# EAGLE design EEprom_Logger_V1 (EAGLE 9.4.2)
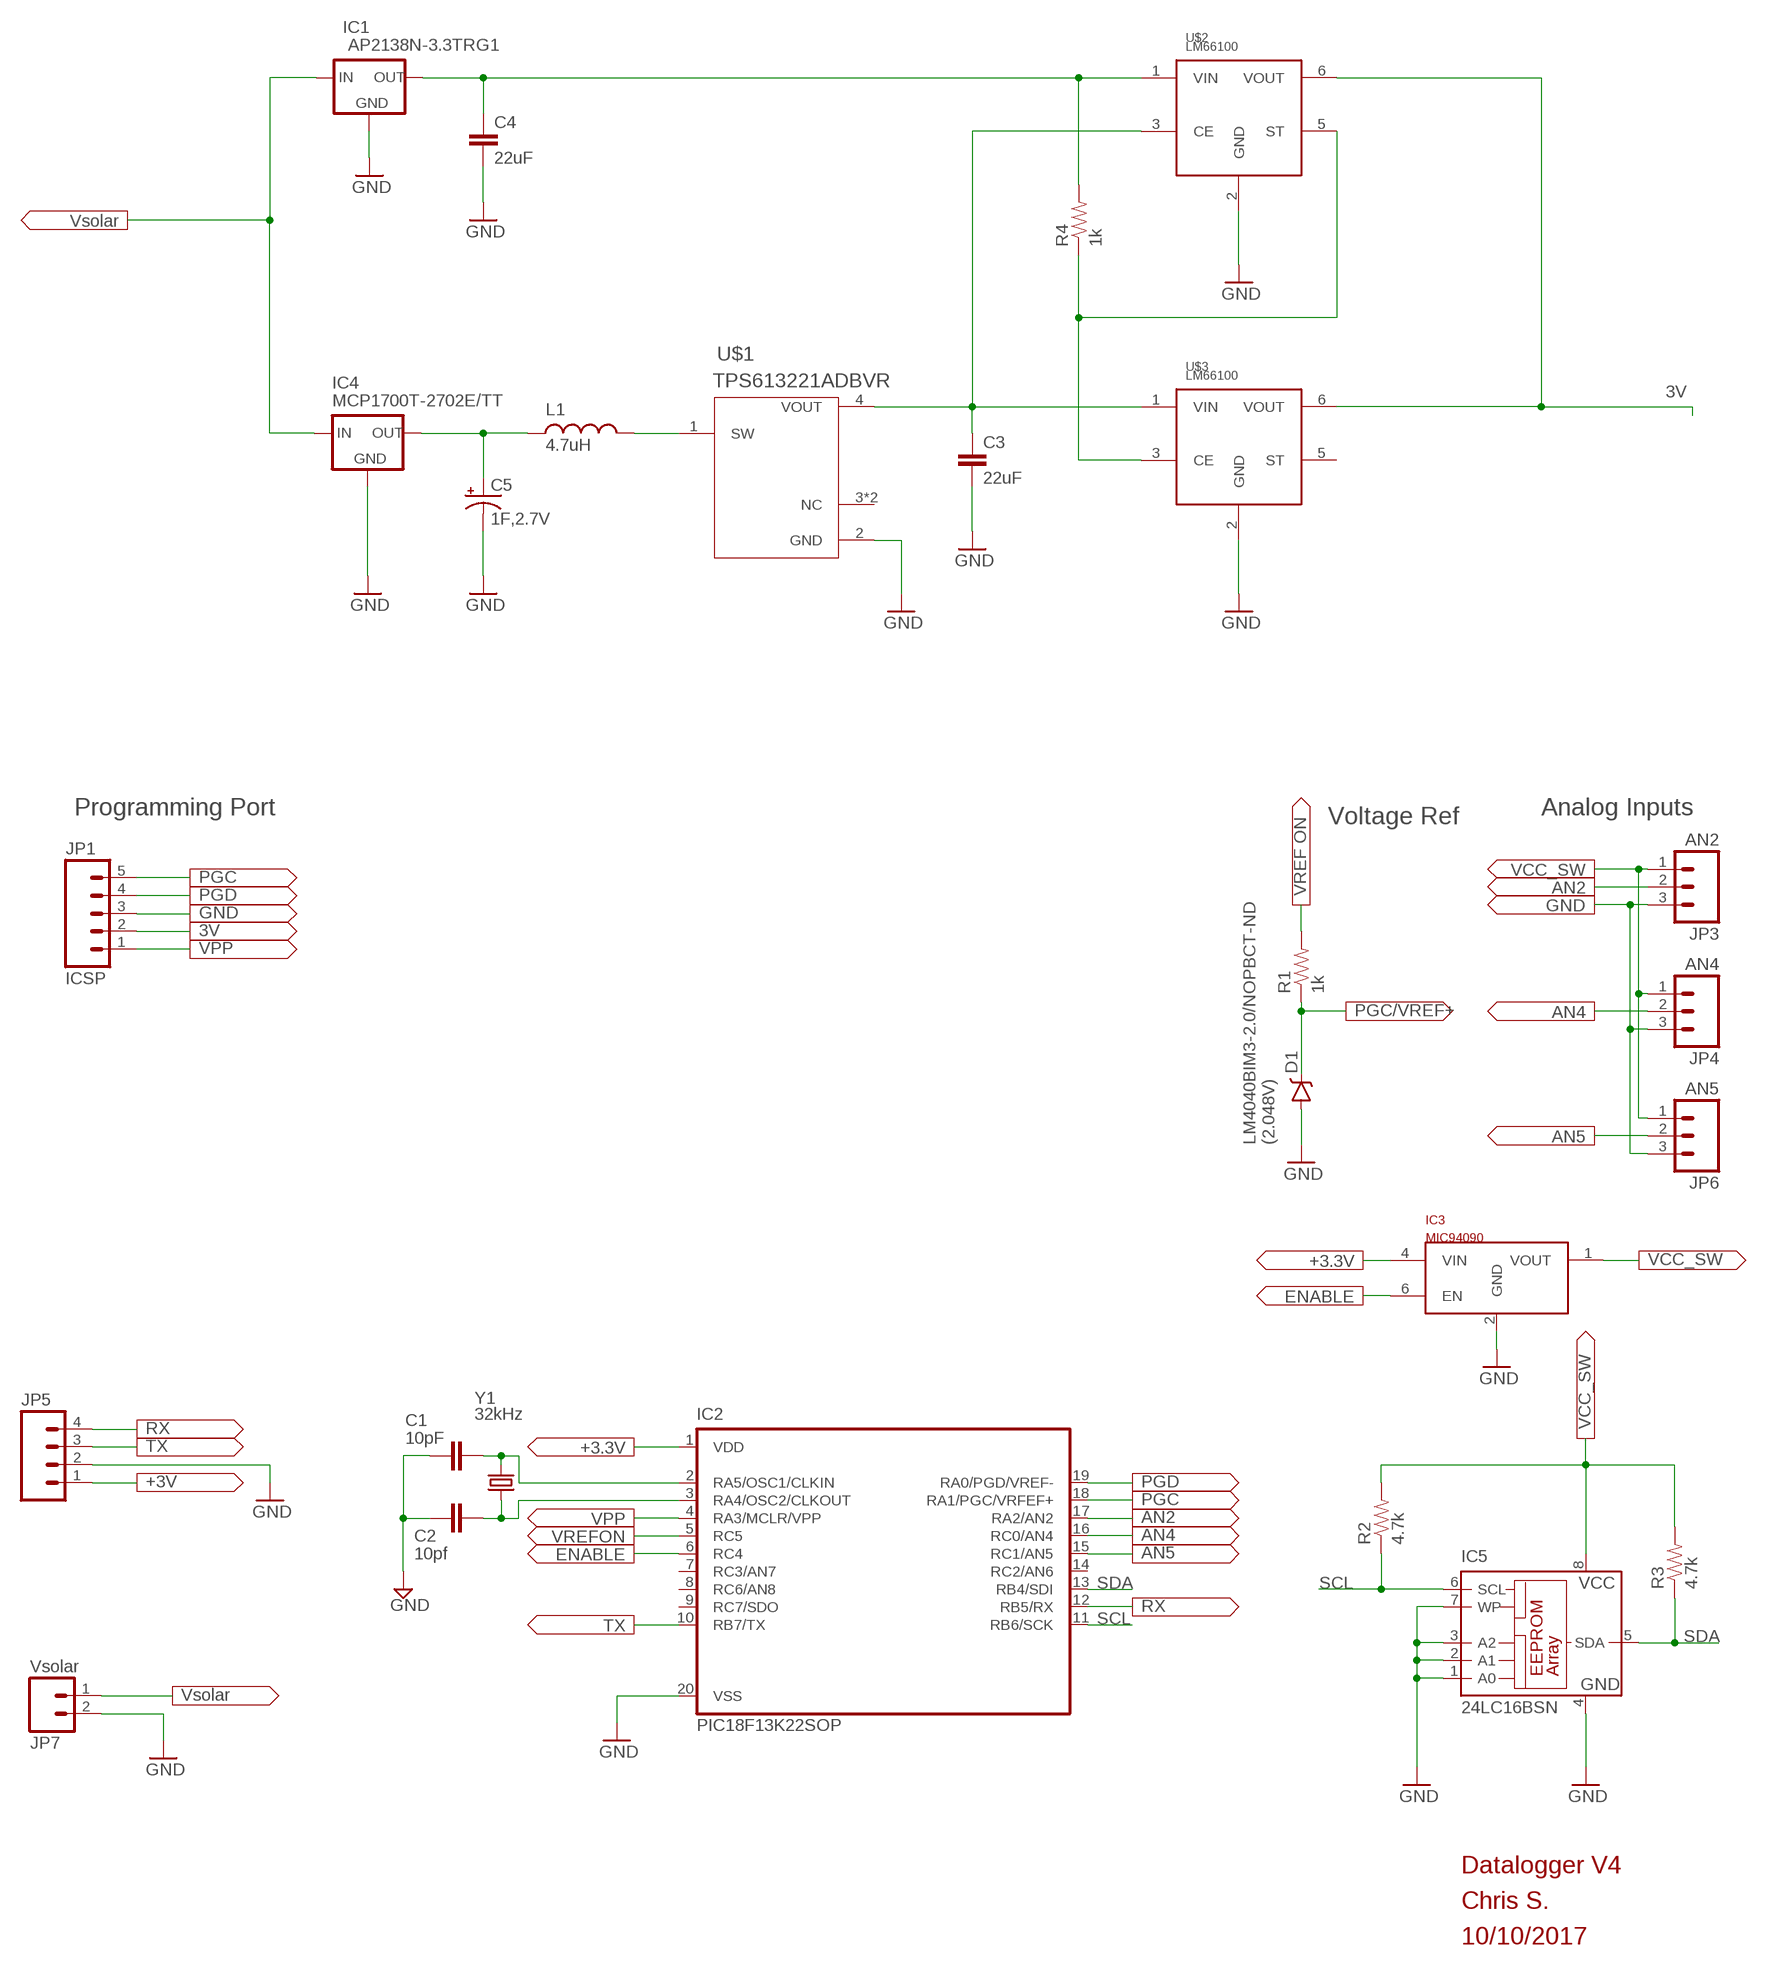
[diagram p0: schematic, sheet 1]

## Parts
C1  10pF  CAP1206  [1206]
C2  10pf  CAP1206  [1206]
C3  22uF  CAP1206  [1206]
C4  22uF  CAP1206  [1206]
C5  1F,2.7V  CPOL-USE3.5-8  [E3,5-8]
D1  V-REFERENCESMD  [SOT23-3]
IC1  AP2138N-3.3TRG1  XC63FPM  [SOT23]
IC2  PIC18F13K22SOP  [SOP20W]
IC3  MIC94090  [SC-70]
IC4  MCP1700T-2702E/TT  XC63FPM  [SOT23]
IC5  24LC16BSN  [SO-08]
JP1  ICSP  M05PTH  [1X05]
JP3  AN2  M03JST-PTH  [JST-3-PTH]
JP4  AN4  M03JST-PTH  [JST-3-PTH]
JP5  M04PTH  [1X04]
JP6  AN5  M03JST-PTH  [JST-3-PTH]
JP7  Vsolar  M02JST-PTH-2  [JST-2-PTH]
L1  4.7uH  INDUCTOR1210  [1210]
R1  1k  RESISTOR1206  [1206]
R2  4.7k  RESISTOR1206  [1206]
R3  4.7k  RESISTOR1206  [1206]
R4  1k  RESISTOR1206  [1206]
U$1  TPS613221ADBVR  TPS61322  [DBV5-L]
U$2  LM66100  [SC70-6]
U$3  LM66100  [SC70-6]
Y1  32kHz  CRYSTALTC26V  [TC26V]

## Nets
3V: IC2.1(VDD) IC3.4(VIN) JP1.2 JP5.1 U$2.6(VOUT) U$3.6(VOUT)
AN2: IC2.17(RA2/AN2) JP3.2
AN4: IC2.16(RC0/AN4) JP4.2
AN5: IC2.15(RC1/AN5) JP6.2
ENABLE: IC2.6(RC4) IC3.6(EN)
GND: C1.2 C2.2 C3.1 C4.1 C5.- D1.2(A) IC1.1(GND) IC2.20(VSS) IC3.2(GND) IC4.1(GND) IC5.1(A0) IC5.2(A1) IC5.3(A2) IC5.4(GND) IC5.7(WP) JP1.3 JP3.3 JP4.3 JP5.2 JP6.3 JP7.2 U$1.2(GND) U$2.2(GND) U$3.2(GND)
N$1: C1.1 IC2.2(RA5/OSC1/CLKIN) Y1.2
N$2: C2.1 IC2.3(RA4/OSC2/CLKOUT) Y1.1
N$3: C4.2 IC1.2(OUT) R4.2 U$2.1(VIN)
N$4: C5.+ IC4.2(OUT) L1.1
N$5: IC1.3(IN) IC4.3(IN)
N$6: R4.1 U$2.5(ST) U$3.3(CE)
N$9: C3.2 U$1.4(VOUT) U$2.3(CE) U$3.1(VIN)
N$10: L1.2 U$1.1(SW)
PGC: D1.1(C) IC2.18(RA1/PGC/VRFEF+) JP1.5 R1.1
PGD: IC2.19(RA0/PGD/VREF-) JP1.4
RX: IC2.12(RB5/RX) JP5.4
SCL: IC2.11(RB6/SCK) IC5.6(SCL) R2.1
SDA: IC2.13(RB4/SDI) IC5.5(SDA) R3.1
SWITCHED_VCC: IC3.1(VOUT) IC5.8(VCC) JP3.1 JP4.1 JP6.1 R2.2 R3.2
TX: IC2.10(RB7/TX) JP5.3
VPP: IC2.4(RA3/MCLR/VPP) JP1.1
VREFON: IC2.5(RC5) R1.2
VSOLAR: JP7.1
Unconnected: IC2.7(RC3/AN7) IC2.8(RC6/AN8) IC2.9(RC7/SDO) IC2.14(RC2/AN6) U$1.3(NC) U$1.5(NC) U$3.5(ST)

## Notes on the sheet
- Programming Port | Analog Inputs
- Voltage Ref
- LM4040BIM3-2.0/NOPBCT-ND
  (2.048V)
- Datalogger V4
- Chris S.
- 10/10/2017

## Library data of the parts
C1-C4 = SparkFun-Capacitors:CAP: Capacitor Standard 0603 ceramic capacitor, and 0.1" leaded capacitor.
C5 = rcl:CPOL-US: POLARIZED CAPACITOR, American symbol; SPICEPREFIX: C
D1 = SparkFun-DiscreteSemi:V-REFERENCE: Zener diode
IC1 IC4 = v-reg:XC63FP: Positiv Voltage Regulators www.torex.co.jp/english/product/pro02/pdf/0201_xc62fp.pdf
IC2 = PIC18F13k22:PIC18F13K22?: 18/20/28-Pin High-Performance, Enhanced Flash Microcontrollers with 10-bit A/D and nanoWatt Technology Source: ww1.microchip.com/downloads/en/DeviceDoc/39605c.pdf
IC3 = MIC94090:MIC94090: MIC94090 Load switch 130mOhm ON 1.2A Conti. Current
IC5 = microchip:24*: Serial EEPROM I2C; MF: MICROCHIP; MPN: 24LC16B/SN; OC_FARNELL: 9757945; OC_NEWARK: 12C2012
JP1 = SparkFun-Connectors:M05: Header 5 Standard 5-pin 0.1" header. Use with straight break away headers (SKU : PRT-00116), right angle break away headers (PRT-00553), swiss pins (PRT-00743), machine pins (PRT-00117), and female headers (PRT-00115). Molex polarized connector foot print use with SKU : PRT-08230 with associated crimp pins and housings.
JP3 JP4 JP6 = SparkFun-Connectors:M03: Header 3 Standard 3-pin 0.1" header. Use with straight break away headers (SKU : PRT-00116), right angle break away headers (PRT-00553), swiss pins (PRT-00743), machine pins (PRT-00117), and female headers (PRT-00115). Molex polarized connector foot print use with SKU : PRT-08232 with associated crimp pins and housings.; SKU: PRT-09915
JP5 = SparkFun-Connectors:M04: Header 4 Standard 4-pin 0.1" header. Use with straight break away headers (SKU : PRT-00116), right angle break away headers (PRT-00553), swiss pins (PRT-00743), machine pins (PRT-00117), and female headers (PRT-00115). Molex polarized connector foot print use with SKU : PRT-08231 with associated crimp pins and housings. 1MM SMD Version SKU: PRT-10208
JP7 = SparkFun-Connectors:M02: Standard 2-pin 0.1" header. Use with - straight break away headers ( PRT-00116) - right angle break away headers (PRT-00553) - swiss pins (PRT-00743) - machine pins (PRT-00117) - female headers (PRT-00115) Molex polarized connector foot print use with: PRT-08233 with associated crimp pins and housings. 2.54_SCREWTERM for use with PRT-10571. 3.5mm Screw Terminal footprints for PRT-08084 5mm Screw Terminal footprints for use with PRT-08432; SKU: PRT-09914
L1 = SparkFun-Passives:INDUCTOR: Inductors Basic Inductor/Choke - 0603 and 1206. Footprints are not proven and vary greatly between part numbers. SRN6045- 33uH, 20% 1.4A SDR0403-560KL - 56uH, 10%, 500mA RMS/740mA peak
R1-R4 = SparkFun-Resistors:RESISTOR: Resistor Basic schematic elements and footprints for 0603, 1206, and PTH resistors.
U$1 = ‎TPS613221:TPS61322
U$2 U$3 = LM66100:LM66100
Y1 = crystal:CRYSTAL: CRYSTAL; OC_FARNELL: unknown; OC_NEWARK: unknown

## Board
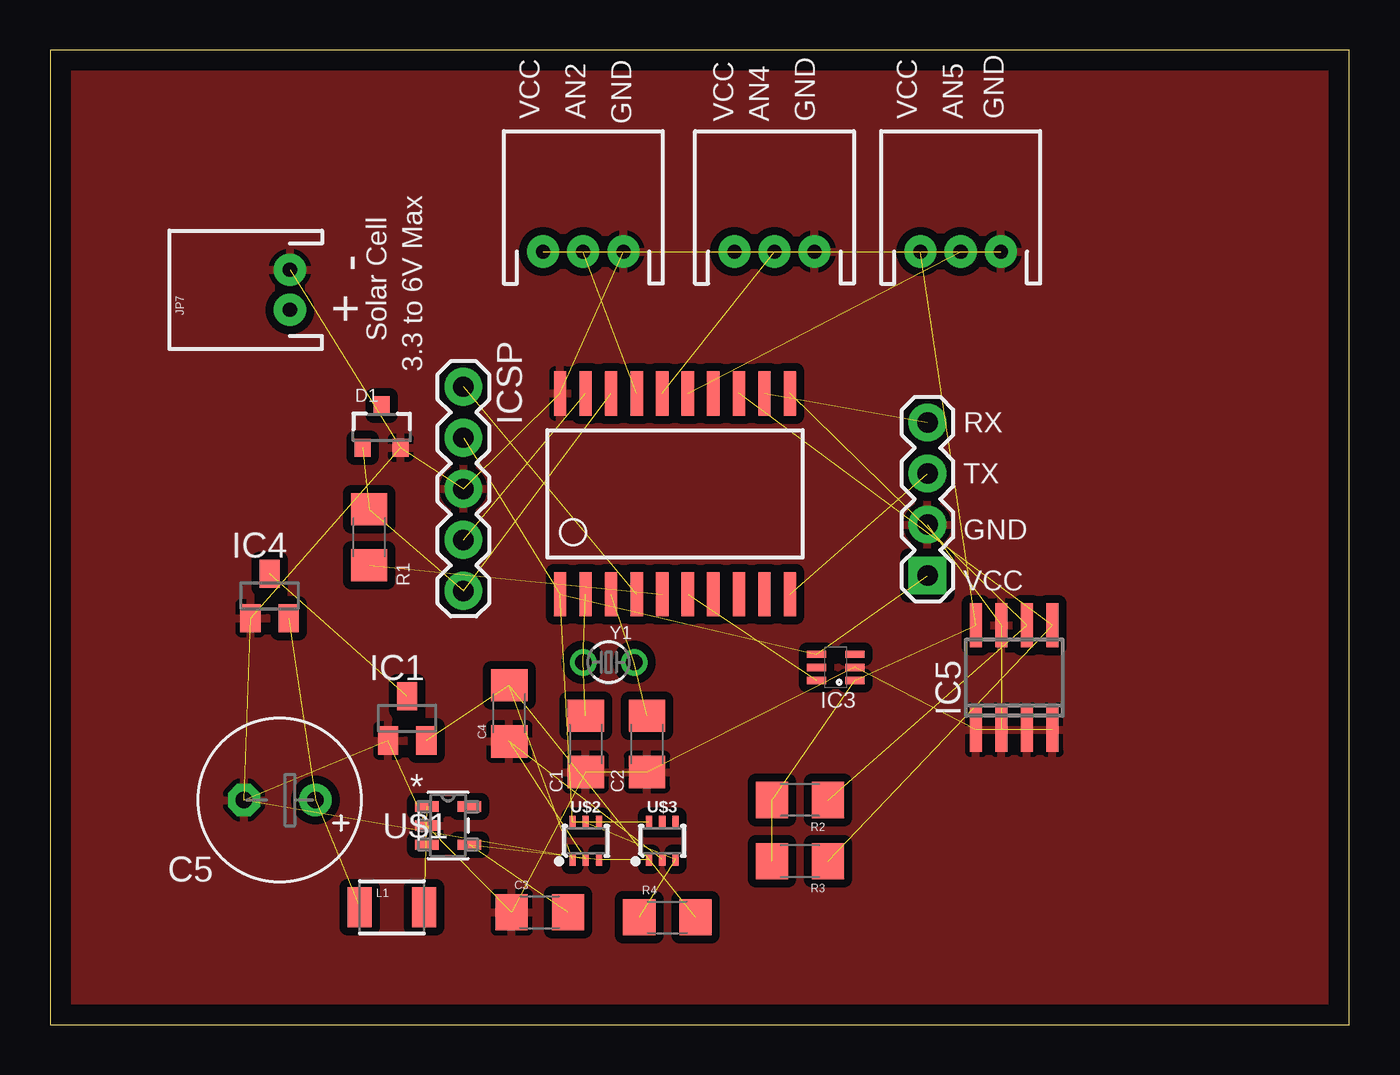
[diagram p1: board, top side]
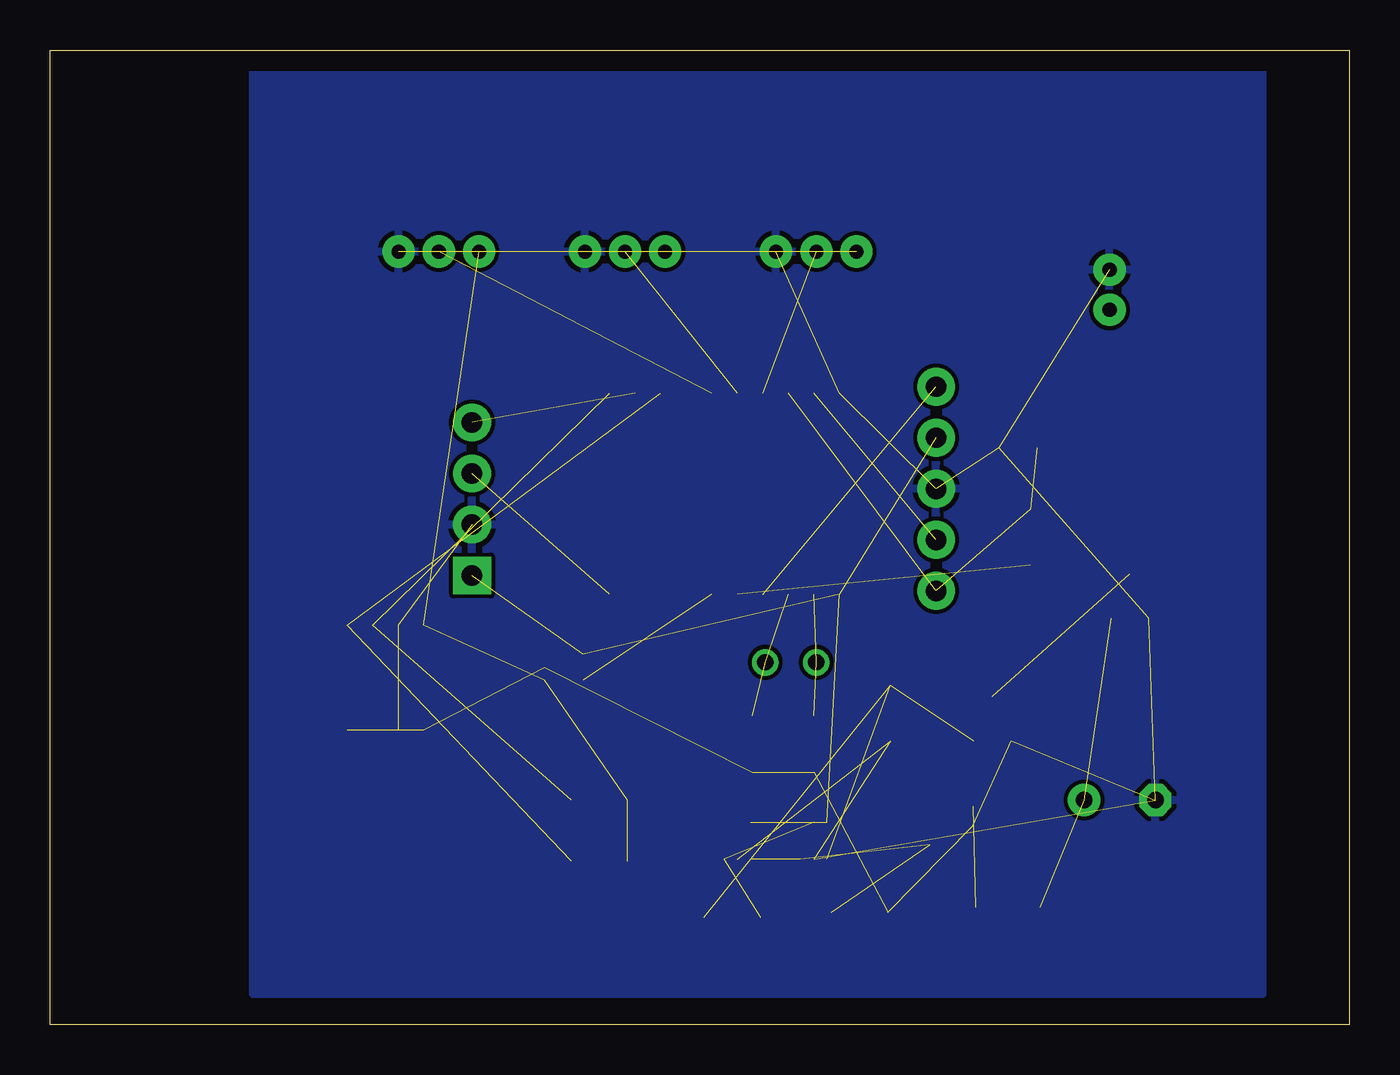
[diagram p2: board, bottom side, seen from below]

Size 64.69 x 48.5 mm. Coordinates in mm from the lower left corner, seen from the top.
Outline: 64.69,48.5 0,48.5 0,0 64.69,0 64.69,48.5
Copper layers (1*16): Top 0.035mm / dielectric 1.5mm / Bottom 0.035mm
Design rules "default": minimum track width 10mil, minimum drill 24mil, track to track 8mil, track to pad 8mil, pad to pad 8mil, via to via 8mil, smd to smd 8mil, copper to edge 40mil, drill to drill 8mil, minimum pad ring 10mil, minimum via ring 8mil, stop-mask expansion 4mil, vias tented up to drill 0mil, thermal gap 10mil

### Footprints (pad centres in the part's own frame; a part is rotated, then mirrored left to right if it is on the bottom)
1206 = smd 1.6 x 1.8: 1 -1.4,0; 2 1.4,0
E3,5-8 = drill 0.813 pad 1.6: + -1.778,0 | drill 0.813 pad 1.6 octagon: - 1.778,0
SOT23-3 = smd 0.8 x 0.9: 1 -0.95,-1; 2 0.95,-1; 3 0,1.1
SOT23 = smd 1 x 1.4: 1 -0.95,-1.1; 2 0.95,-1.1; 3 0,1.1
SOP20W = smd 0.6 x 2.2: 1 -5.715,-5; 2 -4.445,-5; 3 -3.175,-5; 4 -1.905,-5; 5 -0.635,-5; 6 0.635,-5; 7 1.905,-5; 8 3.175,-5; 9 4.445,-5; 10 5.715,-5; 11 5.715,5; 12 4.445,5; 13 3.175,5; 14 1.905,5; 15 0.635,5; 16 -0.635,5; 17 -1.905,5; 18 -3.175,5; 19 -4.445,5; 20 -5.715,5
SC-70 = smd 0.36 x 0.95: 1 -0.65,-0.95; 2 0,-0.95; 3 0.65,-0.95; 4 0.65,0.95; 5 0,0.95; 6 -0.65,0.95
SO-08 = smd 0.6 x 2.2: 1 -1.905,-2.6; 2 -0.635,-2.6; 3 0.635,-2.6; 4 1.905,-2.6; 5 1.905,2.6; 6 0.635,2.6; 7 -0.635,2.6; 8 -1.905,2.6
1X05 = drill 1.016 pad 1.88: 1 0,0; 2 2.54,0; 3 5.08,0; 4 7.62,0; 5 10.16,0
JST-3-PTH = drill 0.7 pad 1.6: 1 -2,0; 2 0,0; 3 2,0
1X04 = drill 1.016 pad 1.88 square: 1 0,0 | drill 1.016 pad 1.88: 2 2.54,0; 3 5.08,0; 4 7.62,0
JST-2-PTH = drill 0.7 pad 1.6: 1 -1,0; 2 1,0
1210 = smd 1.2 x 2: 1 -1.6,0; 2 1.6,0
DBV5-L = smd 1.168 x 0.508: 1 -1.067,0.95; 2 -1.067,0; 3 -1.067,-0.95; 4 1.067,-0.95; 5 1.067,0.95
SC70-6 = smd 0.3 x 0.66: 1 -0.65,-0.92; 2 0,-0.92; 3 0.65,-0.92; 4 0.65,0.92; 5 0,0.92; 6 -0.65,0.92
TC26V = drill 0.813: 1 -1.27,0; 2 1.27,0

### Placement (x,y rotation side)
C1  26.67,13.97 270 top
C2  29.72,13.97 270 top
C3  24.38,5.59 0 top
C4  22.86,15.49 90 top
C5  11.43,11.18 180 top
D1  16.51,29.72 0 top
IC1  17.78,15.24 0 top
IC2  31.11,26.42 0 top
IC3  39.12,17.78 90 top
IC4  10.92,21.34 0 top
IC5  48.01,17.27 0 top
JP1  20.57,31.75 270 top
JP3  26.54,38.48 0 top
JP4  36.07,38.48 0 top
JP5  43.69,22.35 90 top
JP6  45.34,38.48 0 top
JP7  11.94,36.58 90 top
L1  17.02,5.84 0 top
R1  15.88,24.26 270 top
R2  37.34,11.18 180 top
R3  37.34,8.13 180 top
R4  30.73,5.33 0 top
U$1  19.81,9.91 0 top
U$2  26.67,9.14 0 top
U$3  30.48,9.14 0 top
Y1  27.81,18.03 180 top

### Tracks (layer width: path | path; a pad name or v marks a point on that pad's centre or on a via)
3V  (5 unrouted)
AN2  (1 unrouted)
AN4  (1 unrouted)
AN5  (1 unrouted)
ENABLE  (1 unrouted)
GND  (23 unrouted)
  pour Top (isolate 0.406): -0.51,48.51 73.15,48.51 73.15,0 -0.51,0
  pour Bottom: 6.6,50.04 54.61,50.04 54.61,1.52 4.32,1.52 4.32,50.04
N$1  (2 unrouted)
N$2  (2 unrouted)
N$3  (3 unrouted)
N$4  (2 unrouted)
N$5  (1 unrouted)
N$6  (2 unrouted)
N$9  (3 unrouted)
N$10  (1 unrouted)
PGC  (3 unrouted)
PGD  (1 unrouted)
RX  (1 unrouted)
SCL  (2 unrouted)
SDA  (2 unrouted)
SWITCHED_VCC  (6 unrouted)
TX  (1 unrouted)
VPP  (1 unrouted)
VREFON  (1 unrouted)

### Text on the board
tPlace: RX | TX | GND | VCC
tNames: VCC | AN2 | VCC | AN4 | GND | VCC | AN5 | GND | GND | - | + | Solar Cell | 3.3 to 6V Max | IC3